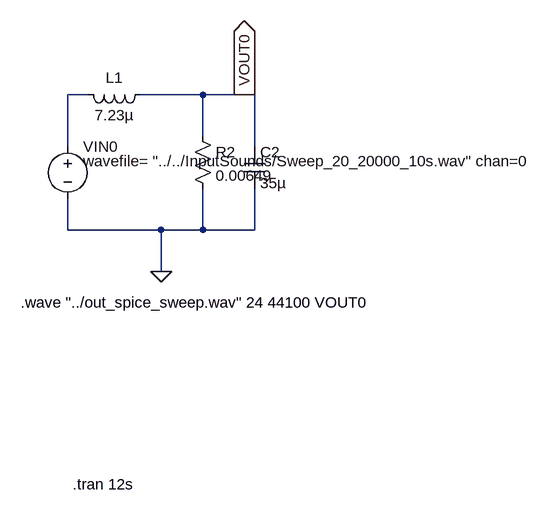
[diagram p0: schematic RLCLowpassFilter.asc]
RLCLowpassFilter.asc, the LTspice schematic file:
Version 4
SHEET 1 2432 680
WIRE 816 0 784 0
WIRE 992 0 896 0
WIRE 1056 0 992 0
WIRE 1072 0 1056 0
WIRE 992 64 992 0
WIRE 784 80 784 0
WIRE 1072 80 1072 0
WIRE 784 208 784 160
WIRE 928 208 784 208
WIRE 992 208 992 144
WIRE 992 208 928 208
WIRE 1072 208 1072 144
WIRE 1072 208 992 208
WIRE 928 272 928 208
FLAG 928 272 0
FLAG 1056 0 VOUT0
IOPIN 1056 0 Out
SYMBOL cap 1056 80 R0
SYMATTR InstName C2
SYMATTR Value 35µ
SYMBOL res 976 48 R0
SYMATTR InstName R2
SYMATTR Value 0.00649
SYMBOL voltage 784 64 R0
WINDOW 3 24 38 Left 2
SYMATTR Value wavefile= "../../InputSounds/Sweep_20_20000_10s.wav" chan=0
SYMATTR InstName VIN0
SYMBOL /ind 912 -16 R90
WINDOW 0 5 56 VBottom 2
WINDOW 3 32 56 VTop 2
SYMATTR InstName L1
SYMATTR Value 7.23µ
TEXT 712 320 Left 2 !.wave "../out_spice_sweep.wav" 24 44100 VOUT0
TEXT 792 600 Left 2 !.tran 12s

The netlist it stands for:
* RLCLowpassFilter.asc
C2 VOUT0 0 35µ
R2 VOUT0 0 0.00649
VIN0 N001 0 wavefile= "../../InputSounds/Sweep_20_20000_10s.wav" chan=0
L1 VOUT0 N001 7.23µ
.wave "../out_spice_sweep.wav" 24 44100 VOUT0
.tran 12s
.backanno
.end